# Altium schematic sheet Sheet3.SchDoc
size A4
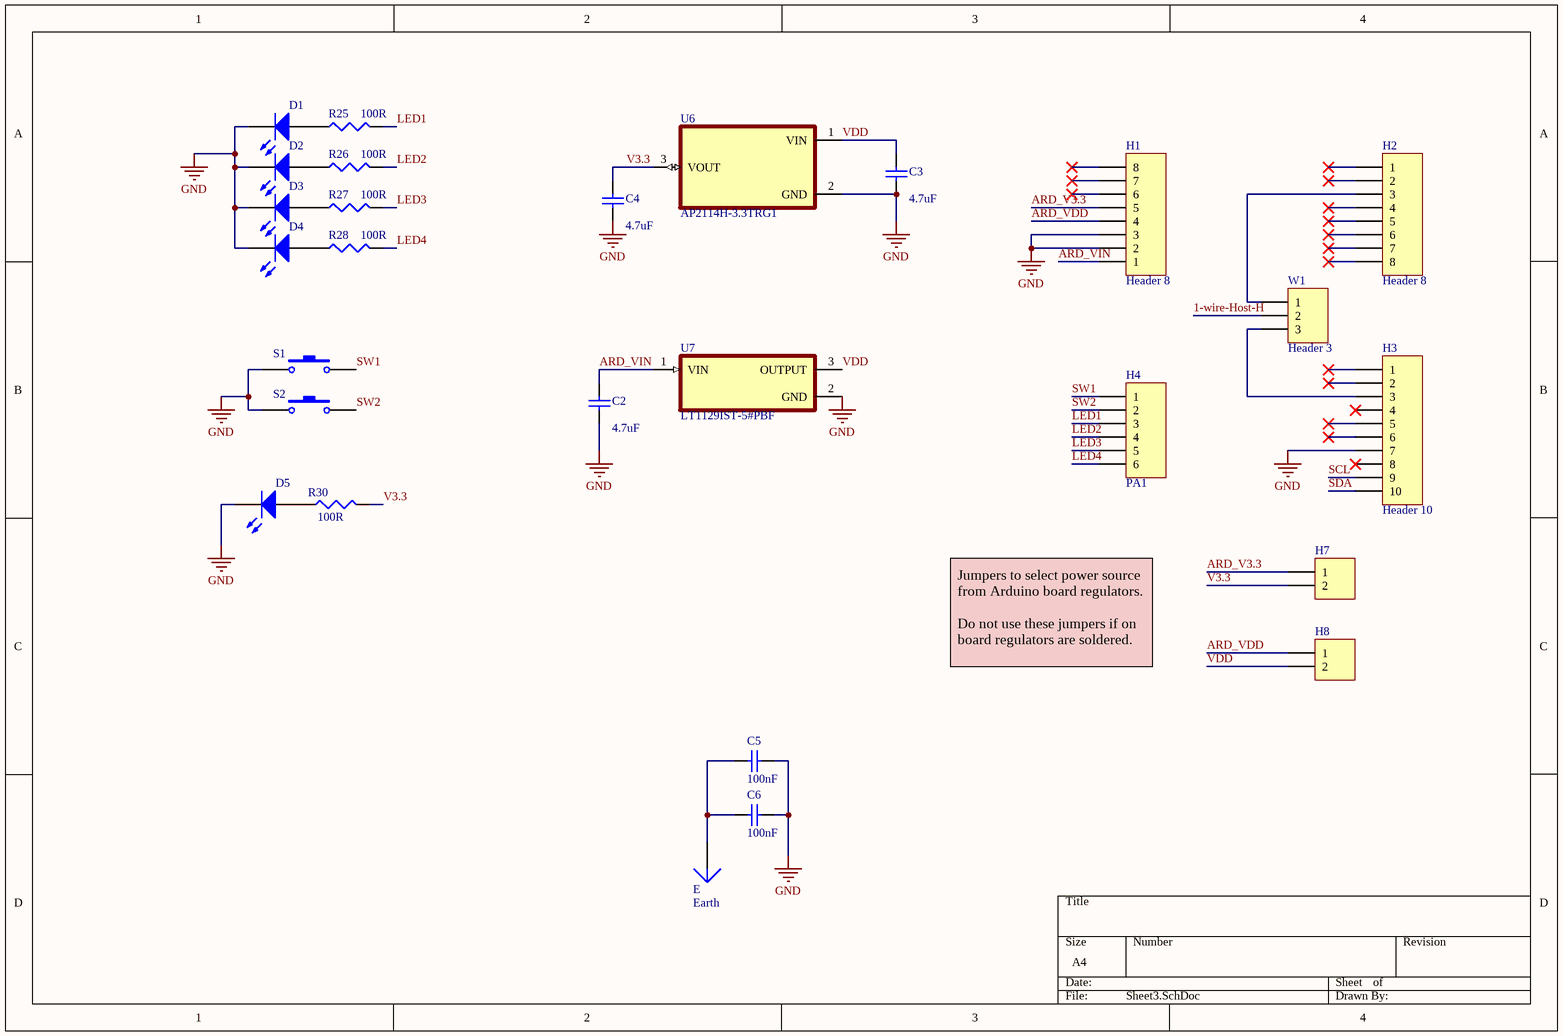
[diagram p0: Sheet3.SchDoc]

## Parts
C2  value 4.7uF  [C0805]
C3  value 4.7uF  [C0805]
C4  value 4.7uF  [C0805]
C5  value 100nF  [CAPC1608L]
C6  value 100nF  [CAPC1608L]
D1  (no value)  [6-0805_N]
D2  (no value)  [6-0805_N]
D3  (no value)  [6-0805_N]
D4  (no value)  [6-0805_N]
D5  (no value)  [6-0805_N]
E  Earth  [PIN1]
H1  Header 8  [HDR1X8]
H2  Header 8  [HDR1X8]
H3  Header 10  [HDR1X10]
H4  PA1  [HDR1X6]
H7  (no value)  [HDR1X2]
H8  (no value)  [HDR1X2]
R25  value 100R  [J1-0603]
R26  value 100R  [J1-0603]
R27  value 100R  [J1-0603]
R28  value 100R  [J1-0603]
R30  value 100R  [J1-0603]
S1  (no value)  [PTS525SM08SMTR2LFS]
S2  (no value)  [PTS525SM08SMTR2LFS]
U6  AP2114H-3.3TRG1  [SOT230P700X180-4N]
U7  LT1129IST-5#PBF  [SOT230P700X180-4N]
W1  Header 3  [HDR1X3]

## Nets
GND: C2.1 C3.1 C4.1 C5.2 C6.2 D1.2(K) D2.2(K) D3.2(K) D4.2(K) D5.2(K) H1.2 H1.3 H3.7 S1.1 S2.1 U6.2(GND) U7.2(GND)
1-wire-Host-H: W1.2
ARD_V3.3: H1.5 H7.1
ARD_VDD: H1.4 H8.1
ARD_VIN: C2.2 H1.1 U7.1(VIN)
LED1: H4.3 R25.1
LED2: H4.4 R26.1
LED3: H4.5 R27.1
LED4: H4.6 R28.1
SCL: H3.9
SDA: H3.10
SW1: H4.1 S1.2
SW2: H4.2 S2.2
V3.3: C4.2 H7.2 R30.1 U6.3(VOUT)
VDD: C3.2 H8.2 U6.1(VIN) U7.3(OUTPUT)
NetC5_1: C5.1 C6.1 E.1
NetD1_1: D1.1(A) R25.2
NetD2_1: D2.1(A) R26.2
NetD3_1: D3.1(A) R27.2
NetD4_1: D4.1(A) R28.2
NetD5_1: D5.1(A) R30.2
NetH2_3: H2.3 W1.1
NetH3_3: H3.3 W1.3

Not connected (* = marked no-connect by the designer): H1 6* 7* 8*; H2 1* 2* 4* 5* 6* 7* 8*; H3 1* 2* 4* 5* 6* 8*

## Notes on the sheet
- Jumpers to select power source from Arduino board regulators.
  Do not use these jumpers if on board regulators are soldered.

## Library data of the parts
C2-C6 = Cap Semi: Capacitor (Semiconductor SIM Model); Published: 8-Jun-2000; LatestRevisionDate: 29-May-2009; LatestRevisionNote: IPC-7351 Footprint Added.; PackageReference: C1206; Publisher: Altium Limited; PackageDescription: Chip Capacitor
D1-D5 = LED3: Typical BLUE SiC LED; Published: 8-Jun-2000; LatestRevisionDate: 17-Dec-2003; LatestRevisionNote: PCB Footprint replaced.; DatasheetVersion: 16-Apr-2002; PackageVersion: 16-Apr-2002; PackageReference: 3.5X2.8X1.9; Publisher: Altium Limited; PackageDescription: SM LED; 2 C-Bend Leads; Body 3.5 x 2.8 x 1.9 mm, inc leads (LxWxH typ)
E = Plug: LatestRevisionDate: 17-Jul-2002; LatestRevisionNote: Re-released for DXP Platform.; Publisher: Altium Limited
H1 H2 = Header 8: Header, 8-Pin; LatestRevisionDate: 17-Jul-2002; LatestRevisionNote: Re-released for DXP Platform.; Publisher: Altium Limited
H3 = Header 10: Header, 10-Pin; LatestRevisionDate: 17-Jul-2002; LatestRevisionNote: Re-released for DXP Platform.; Publisher: Altium Limited
H4 = Header 6: Header, 6-Pin; LatestRevisionDate: 17-Jul-2002; LatestRevisionNote: Re-released for DXP Platform.; Publisher: Altium Limited
H7 H8 = Header 2: Header, 2-Pin; LatestRevisionDate: 17-Jul-2002; LatestRevisionNote: Re-released for DXP Platform.; Publisher: Altium Limited
R25-R28 R30 = Res3: Resistor; Published: 8-Jun-2000; LatestRevisionDate: 29-May-2009; LatestRevisionNote: IPC-7351 Footprint Added.; PackageReference: J1-0603; Publisher: Altium Limited; PackageDescription: Chip Resistor
S1 S2 = SW-PB: Switch; Published: 24-Mar-1999; LatestRevisionDate: 17-Jul-2002; LatestRevisionNote: Re-released for DXP Platform.; PackageReference: SPST-2; Publisher: Altium Limited; PackageDescription: Switch; 2 Leads
U6 = AP2114H-3.3TRG1: MF: {'manufacturer': u'Diodes Inc.'}; Price: None; Availability: Unavailable; Value: *; MP: AP2114H-3.3TRG1; Package: None
U7 = LT1129IST-5#PBF: MF: {'manufacturer': u'Analog Devices'}; Availability: Unavailable; Price: None; Value: *; MP: LT1129IST-5#PBF; Package: None
W1 = Header 3: Header, 3-Pin; LatestRevisionDate: 17-Jul-2002; LatestRevisionNote: Re-released for DXP Platform.; Publisher: Altium Limited